# Altium schematic sheet SCH_Logic_And_Gate.SchDoc
size A; SheetNumber: 1; SheetTotal: 1
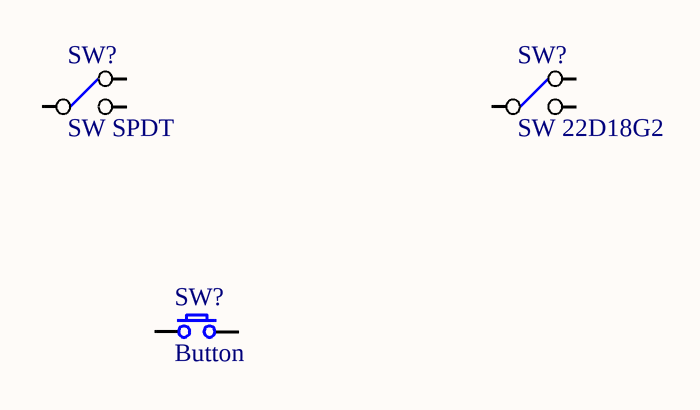
[diagram p0: SCH_Logic_And_Gate.SchDoc]

## Parts
(Parts that share a designator on the sheet are numbered #1, #2 ... from top to bottom, then left to right.)
SW?#1  SW SPDT  [SW/3/SPDT/SS12D10]
SW?#2  SW 22D18G2  [MST22D18G2]
SW?#3  Button  [SW/4/SMD/XS]

## Nets

Not connected (* = marked no-connect by the designer): SW?#1 1(NC1) 2(COMMON1) 3(NO1); SW?#2 1(NC1) 2(COMMON1) 3(NO1); SW?#3 1 2

## Library data of the parts
SW?#3 = SW SPST: Tact switch 2 pin